# EAGLE design v5.mainboard.omega (EAGLE 9.5.1)
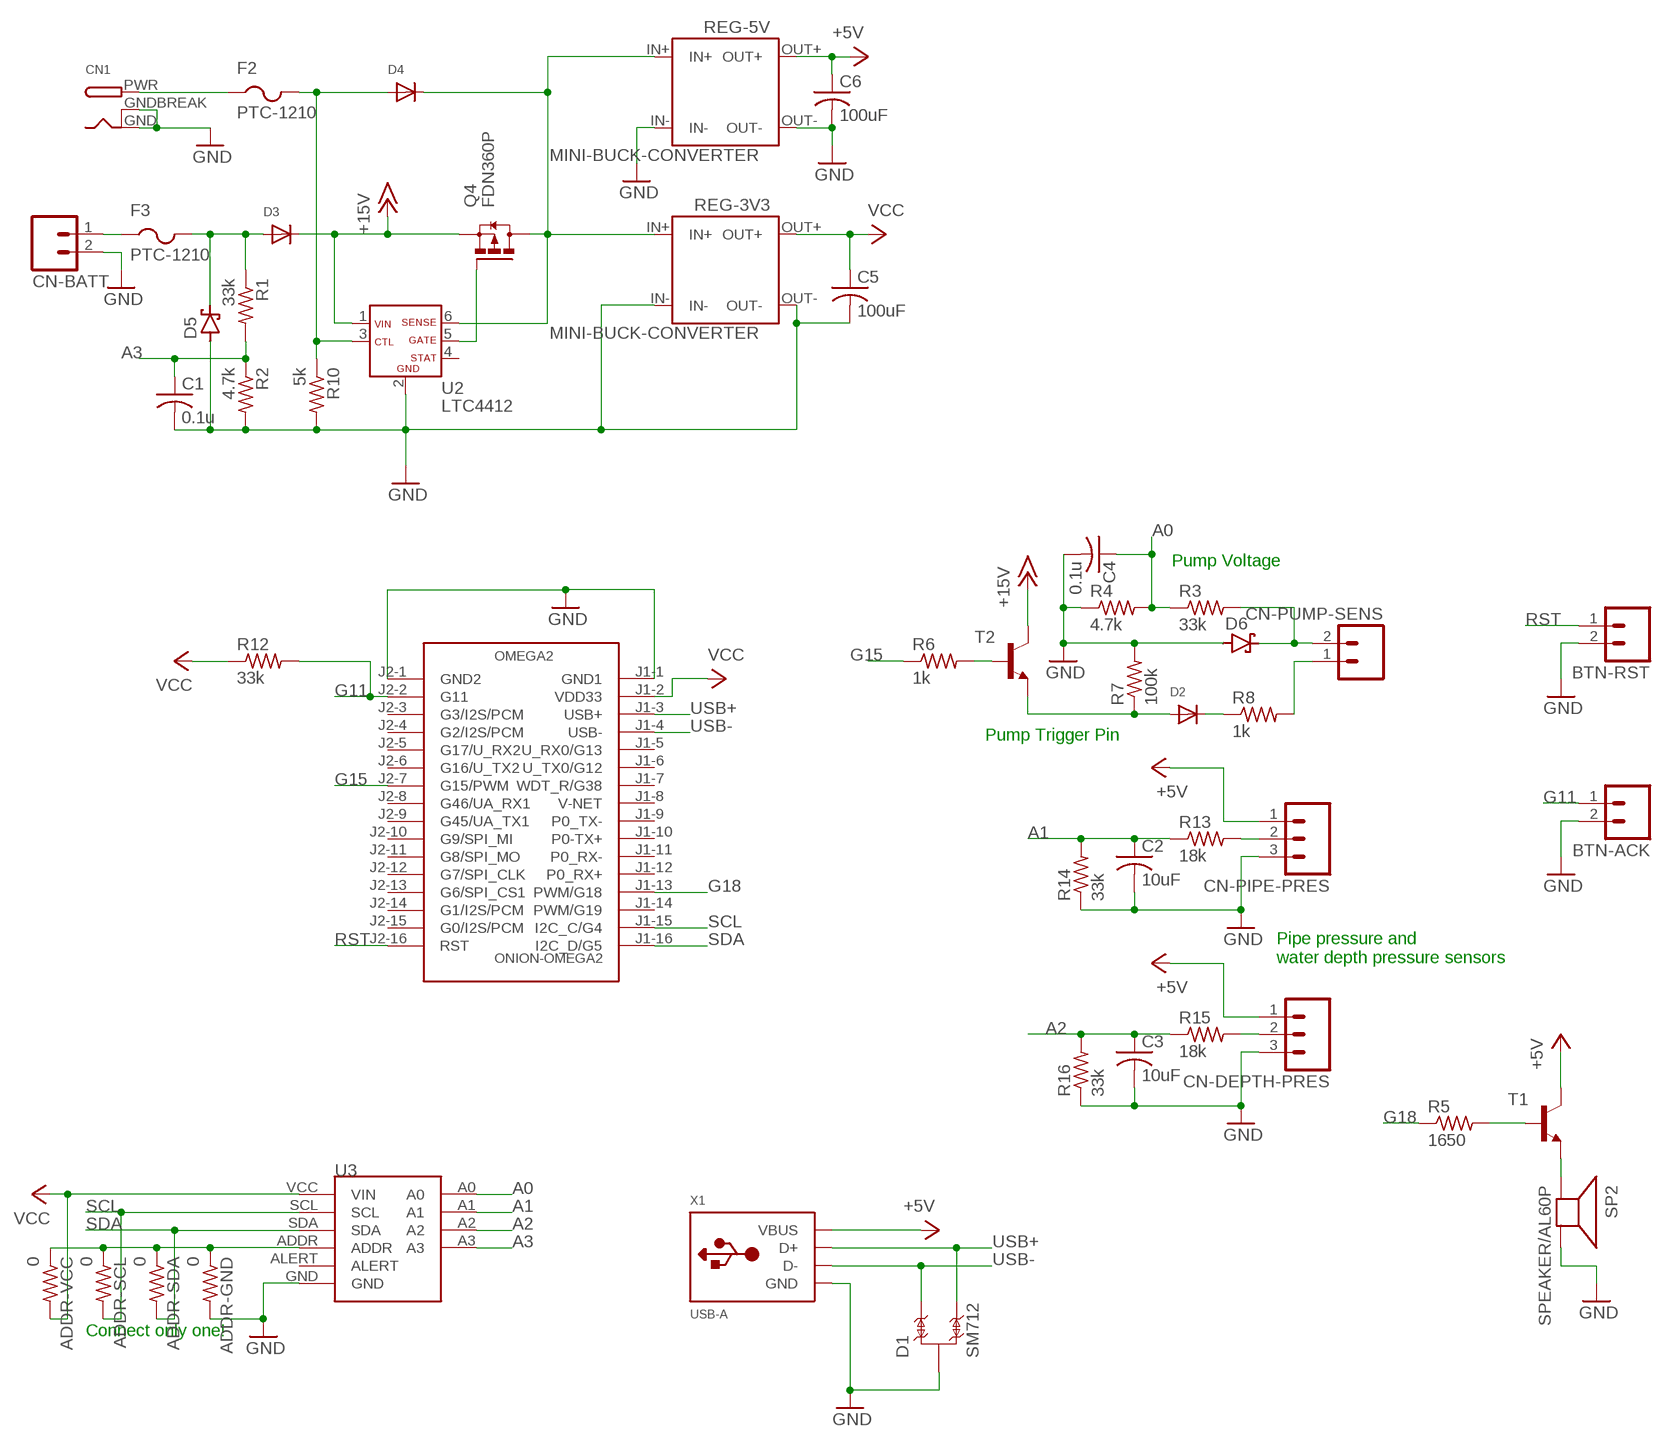
[diagram p0: schematic, sheet 1]

## Parts
ADDR-GND  0  R-US_R0603  [R0603]
ADDR-SCL  0  R-US_R0603  [R0603]
ADDR-SDA  0  R-US_R0603  [R0603]
ADDR-VCC  0  R-US_R0603  [R0603]
BTN-ACK  M02  [02P]
BTN-RST  M02  [02P]
C1  0.1u  C-USC0603K  [C0603K]
C2  10uF  C-USC0805K  [C0805K]
C3  10uF  C-USC0805K  [C0805K]
C4  0.1u  C-USC0603K  [C0603K]
C5  100uF  C-USC2220K  [C2220K]
C6  100uF  C-USC2220K  [C2220K]
CN1  DCBARRELPTH  [DCJACK_2MM_PTH]
CN-BATT  M02  [02P]
CN-DEPTH-PRES  M03  [03P]
CN-PIPE-PRES  M03  [03P]
CN-PUMP-SENS  M02  [02P]
D1  SM712  [SOT23-3]
D2  DIODESMA  [SMADIODE]
D3  DIODESMA  [SMADIODE]
D4  DIODESMA  [SMADIODE]
D5  SCHOTTKY-DIODESMC  [SMC]
D6  SCHOTTKY-DIODESMC  [SMC]
F2  PTC-1210  [1210]
F3  PTC-1210  [1210]
OMEGA2  ONION-OMEGA2  [ONION-2MM-2X16]
Q4  FDN360P  [SUPER-SOT3]
R1  33k  R-US_R0603  [R0603]
R2  4.7k  R-US_R0603  [R0603]
R3  33k  R-US_R0603  [R0603]
R4  4.7k  R-US_R0603  [R0603]
R5  1650  R-US_R0603  [R0603]
R6  1k  R-US_R0603  [R0603]
R7  100k  R-US_R0603  [R0603]
R8  1k  R-US_R0603  [R0603]
R10  5k  R-US_R0603  [R0603]
R12  33k  R-US_R0603  [R0603]
R13  18k  R-US_R0603  [R0603]
R14  33k  R-US_R0603  [R0603]
R15  18k  R-US_R0603  [R0603]
R16  33k  R-US_R0603  [R0603]
REG-3V3  MINI-BUCK-CONVERTER  [MINI-BUCK-CONVERTER]
REG-5V  MINI-BUCK-CONVERTER  [MINI-BUCK-CONVERTER]
SP2  SPEAKER/AL60P  [AL60P]
T1  BC808-NPN-SOT23-BEC  [SOT23-BEC]
T2  BC808-NPN-SOT23-BEC  [SOT23-BEC]
U2  LTC4412  [SOT23-6]
U3  GY-ADS1115THM  [GY-ADS1115-THM]
X1  USB-A  [MOLEX_480371000]

## Nets
+5V: C6.1 CN-DEPTH-PRES.1 CN-PIPE-PRES.1 REG-5V.OUT+ T1.C X1.1(VBUS)
+15V: D3.C Q4.2(S) T2.C U2.1(VIN)
A0: C4.1 R3.1 R4.2 U3.A0
A1: C2.1 R13.1 R14.2 U3.A1
A2: C3.1 R15.1 R16.2 U3.A2
A3: C1.1 R1.2 R2.1 U3.A3
G11: BTN-ACK.1 OMEGA2.J2-2(G11) R12.2
G15: OMEGA2.J2-7(G15/PWM) R6.1
G18: OMEGA2.J1-13(PWM/G18) R5.1
GND: ADDR-GND.2 BTN-ACK.2 BTN-RST.2 C1.2 C2.2 C3.2 C4.2 C5.2 C6.2 CN1.GND CN1.GNDBREAK CN-BATT.2 CN-DEPTH-PRES.3 CN-PIPE-PRES.3 D1.3 D5.A D6.A OMEGA2.J1-1(GND1) OMEGA2.J2-1(GND2) R2.2 R4.1 R7.2 R10.2 R14.1 R16.1 REG-3V3.IN- REG-3V3.OUT- REG-5V.IN- REG-5V.OUT- SP2.2(-) U2.2(GND) U3.GND X1.4(GND)
N$1: Q4.1(G) U2.5(GATE)
N$3: ADDR-GND.1 ADDR-SCL.1 ADDR-SDA.1 ADDR-VCC.1 U3.ADDR
N$4: CN-PUMP-SENS.2 D6.C R3.2
N$5: D2.C R8.1
N$6: CN-PUMP-SENS.1 R8.2
N$7: CN-DEPTH-PRES.2 R15.2
N$8: R5.2 T1.B
N$9: SP2.1(+) T1.E
N$10: CN-PIPE-PRES.2 R13.2
N$12: R6.2 T2.B
N$13: D3.A D5.C F3.2 R1.1
N$14: D2.A R7.1 T2.E
N$15: CN-BATT.1 F3.1
N$16: D4.C Q4.3(D) REG-3V3.IN+ REG-5V.IN+ U2.6(SENSE)
N$17: CN1.PWR F2.1
N$18: D4.A F2.2 R10.1 U2.3(CTL)
RST: BTN-RST.1 OMEGA2.J2-16(RST)
SCL: ADDR-SCL.2 OMEGA2.J1-15(I2C_C/G4) U3.SCL
SDA: ADDR-SDA.2 OMEGA2.J1-16(I2C_D/G5) U3.SDA
USB+: D1.1 OMEGA2.J1-3(USB+) X1.3(D+)
USB-: D1.2 OMEGA2.J1-4(USB-) X1.2(D-)
VCC: ADDR-VCC.2 C5.1 OMEGA2.J1-2(VDD33) R12.1 REG-3V3.OUT+ U3.VCC(VIN)
Unconnected: OMEGA2.J1-5(U_RX0/G13) OMEGA2.J1-6(U_TX0/G12) OMEGA2.J1-7(WDT_R/G38) OMEGA2.J1-8(V-NET) OMEGA2.J1-9(P0_TX-) OMEGA2.J1-10(P0-TX+) OMEGA2.J1-11(P0_RX-) OMEGA2.J1-12(P0_RX+) OMEGA2.J1-14(PWM/G19) OMEGA2.J2-3(G3/I2S/PCM) OMEGA2.J2-4(G2/I2S/PCM) OMEGA2.J2-5(G17/U_RX2) OMEGA2.J2-6(G16/U_TX2) OMEGA2.J2-8(G46/UA_RX1) OMEGA2.J2-9(G45/UA_TX1) OMEGA2.J2-10(G9/SPI_MI) OMEGA2.J2-11(G8/SPI_MO) OMEGA2.J2-12(G7/SPI_CLK) OMEGA2.J2-13(G6/SPI_CS1) OMEGA2.J2-14(G1/I2S/PCM) OMEGA2.J2-15(G0/I2S/PCM) U2.4(STAT) U3.ALERT

## Notes on the sheet
- Pump Voltage
- Pump Trigger Pin
- Pipe pressure and 
  water depth pressure sensors
- Connect only one!

## Library data of the parts
ADDR-GND ADDR-SCL ADDR-SDA ADDR-VCC R1-R8 R10 R12-R16 = adafruit:R-US_: RESISTOR, American symbol
BTN-ACK BTN-RST CN-BATT CN-PUMP-SENS = con-amp-quick:M02: AMP QUICK CONNECTOR; OC_FARNELL: unknown; OC_NEWARK: unknown
C1-C6 = adafruit:C-US: CAPACITOR, American symbol
CN1 = adafruit:DCBARREL: 2.0mm DC Barrel Jack DCJACK_2MM_PTH - Through Hole Jack (4UConnector: 05537)
CN-DEPTH-PRES CN-PIPE-PRES = con-amp-quick:M03: AMP QUICK CONNECTOR; OC_FARNELL: unknown; OC_NEWARK: unknown
D1 = serge:SM712: SM712 Series 600W Asymmetrical TVS Diode Array; Datasheet: http://www.littelfuse.com/~/media/electronics/datasheets/tvs_diode_arrays/littelfuse_tvs_diode_array_sm712_datasheet.pdf.pdf
D2-D4 = adafruit:DIODE: Diode SMADIODE - SMA Surface Mount Package 20V 1A Schottky Diode Digikey: 641-1014-6-ND DO-1N4148 - Through Hole Small Current Diode SOD-123 20V 1 A (.5mV Vf) Schottky Diode - Digikey: MBRX120TPMSCT-ND SOD-323 10V 570mA (.38mV Vf, 3ns) Schottky Diode - Digikey: ZLLS410CT-ND SOD-523 30V 30mA Schottky Diode (RB751S-40TE61) - Digikey: RB751S-40TE61CT-ND SOT23-R/W - SOT23 Package (R = Solder Paste/Reflow Ovens, W = Hand-Soldering) BAT54Film 40V 300mA - Digikey: 497-7162-1-ND
D5 D6 = diode:SCHOTTKY-DIODE: Schottky Diode
F2 F3 = serge:PTC-1210
OMEGA2 = omega:ONION-OMEGA2: Onion Omega
Q4 = transistor-power:FDN360P: Single P-Channel, PowerTrench (R) MOSFET Source: http://www.fairchildsemi.com/ds/FD/FDN360P.pdf
REG-3V3 REG-5V = serge:MINI-BUCK-CONVERTER
SP2 = adafruit:SPEAKER: SPEAKER Source: Buerklin Added PS12 (for part # PS1240 piezo) http://www.ladyada.net/library/pcb/eaglelibrary.html
T1 T2 = transistor:*-NPN-: NPN Transistror BF959 corrected 2008.03.06
U2 = U-LT-LTC4412-ideal-diode:LTC4412
U3 = serge:GY-ADS1115
X1 = adafruit:USB-A: USB type A 'plug' Used for things that can directly connect to a USB port, say USB key

## Board
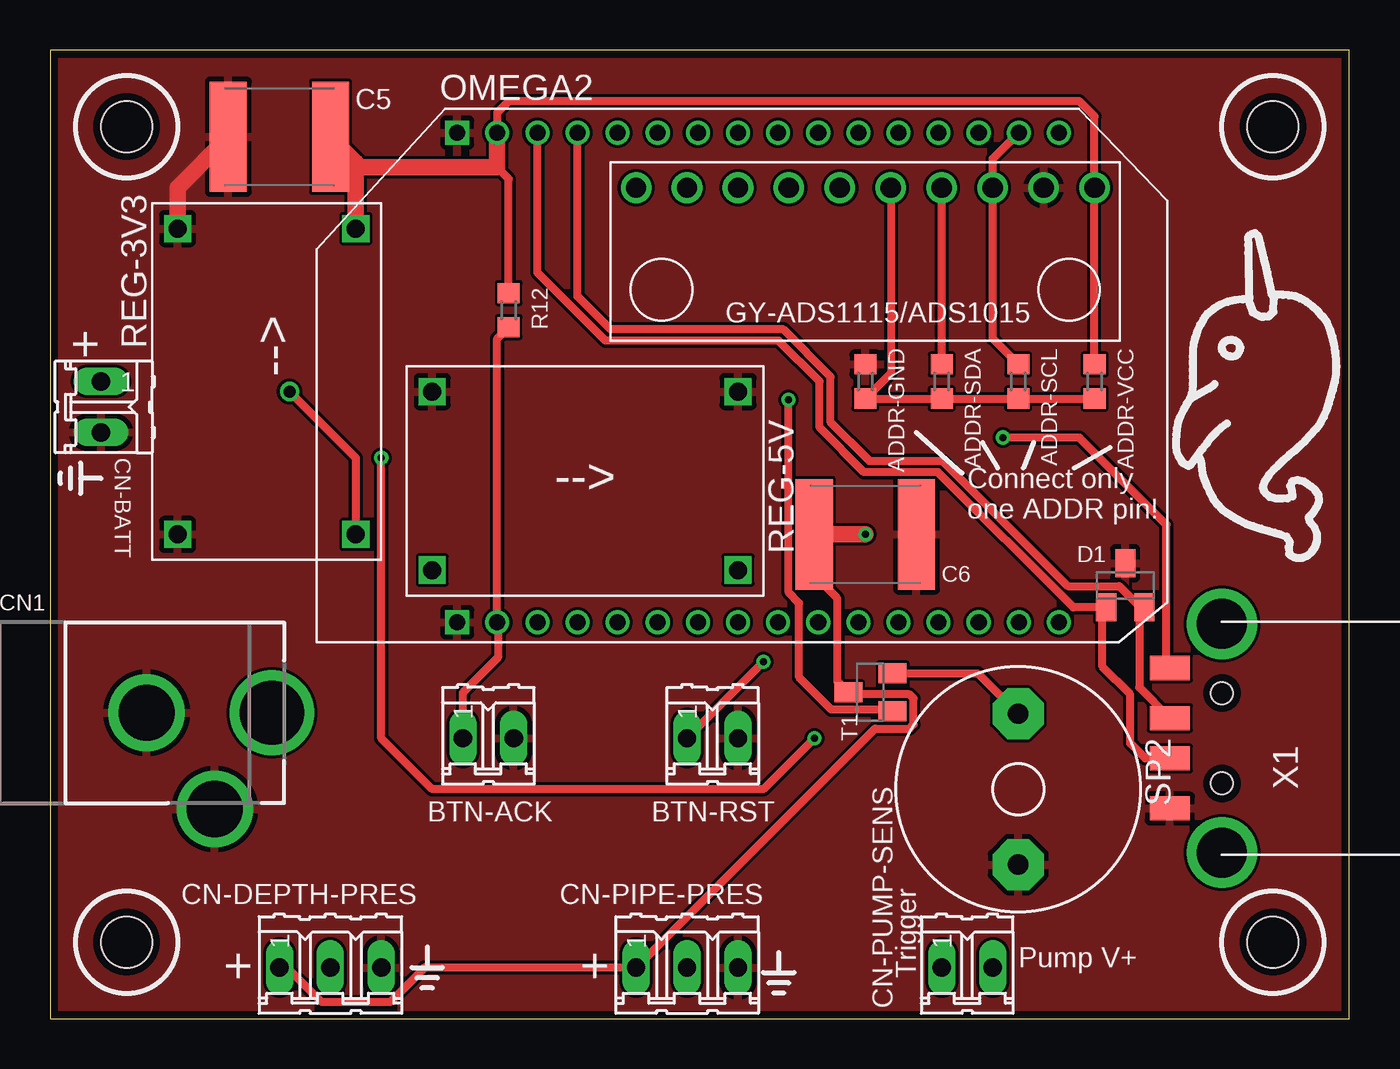
[diagram p1: board, top side]
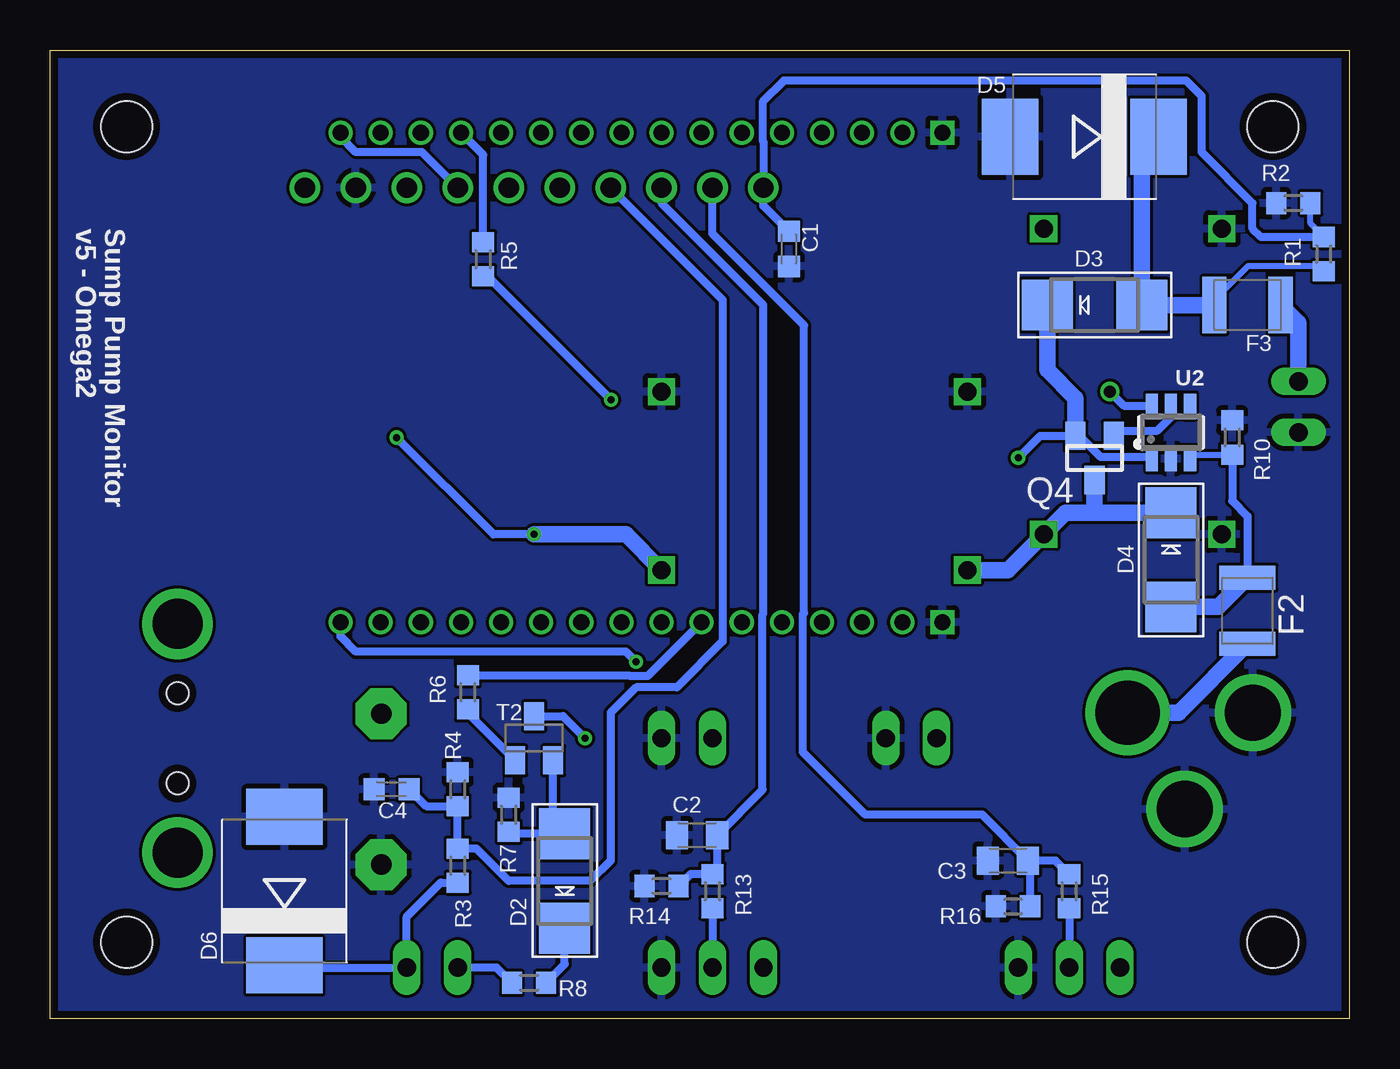
[diagram p2: board, bottom side, seen from below]

Size 64.77 x 48.26 mm. Coordinates in mm from the lower left corner, seen from the top.
Outline: 0,0 64.77,0 64.77,48.26 0,48.26 0,0
Copper layers (1*16): Top 0.0356mm / dielectric 1.5011mm / Bottom 0.0356mm
Design rules "LaenPCBOrder": minimum track width 6mil, minimum drill 13mil, track to track 6mil, track to pad 6mil, pad to pad 6mil, via to via 6mil, smd to smd 6mil, copper to edge 15mil, drill to drill 6mil, minimum pad ring 7mil, minimum via ring 7mil, stop-mask expansion 4mil, vias tented up to drill 0mil, thermal gap 10mil
Holes 2.54 mm at 3.81,3.81 60.96,3.81 60.96,44.45 3.81,44.45

### Footprints (pad centres in the part's own frame; a part is rotated, then mirrored left to right if it is on the bottom)
R0603 = smd 1 x 1.1: 1 -0.85,0; 2 0.85,0
02P = drill 0.914 long: 1 -1.27,0; 2 1.27,0
C0603K = smd 1.05 x 1.08: 1 -0.875,0; 2 0.875,0
C0805K = smd 1.1 x 1.4: 1 -1,0; 2 1,0
C2220K = smd 1.85 x 5.5: 1 -2.55,0; 2 2.55,0
DCJACK_2MM_PTH = drill 2.8: GND 0,7.35; GNDBREAK 4.8,10.75 | drill 3.2: PWR 0,13.6
03P = drill 0.914 long: 1 -2.54,0; 2 0,0; 3 2.54,0
SOT23-3 = smd 1 x 1.4: 1 -0.95,-1.1; 2 0.95,-1.1; 3 0,1.1
SMADIODE = smd 2.54 x 2.54: A 2.349,0; C -2.349,0
SMC = smd 2.8 x 3.8: A 3.7,0; C -3.7,0
1210 = smd 1.2 x 2.8: 1 -1.65,0; 2 1.65,0
ONION-2MM-2X16 = drill 0.8 square: J1-1 12.4,14; J2-1 -12,14 | drill 0.8: J1-2 12.4,12; J1-3 12.4,10; J1-4 12.4,8; J1-5 12.4,6; J1-6 12.4,4; J1-7 12.4,2; J1-8 12.4,0; J1-9 12.4,-2; J1-10 12.4,-4; J1-11 12.4,-6; J1-12 12.4,-8; J1-13 12.4,-10; J1-14 12.4,-12; J1-15 12.4,-14; J1-16 12.4,-16; J2-2 -12,12; J2-3 -12,10; J2-4 -12,8; J2-5 -12,6; J2-6 -12,4; J2-7 -12,2; J2-8 -12,0; J2-9 -12,-2; J2-10 -12,-4; J2-11 -12,-6; J2-12 -12,-8; J2-13 -12,-10; J2-14 -12,-12; J2-15 -12,-14; J2-16 -12,-16
SUPER-SOT3 = smd 1 x 1.4: 1 -0.95,-1.1; 2 0.95,-1.1; 3 0,1.1
MINI-BUCK-CONVERTER = drill 0.9 square: IN+ 10.16,1.27; IN- 1.27,1.27; OUT+ 10.16,16.51; OUT- 1.27,16.51
AL60P = drill 1.016 pad 2.54 octagon: 1 -3.759,0; 2 3.759,0
SOT23-BEC = smd 1 x 1.4: B -0.95,-1.1; C 0,1.1; E 0.95,-1.1
SOT23-6 = smd 0.6 x 1.25: 1 0.95,1.31; 2 0,1.31; 3 -0.95,1.31; 4 -0.95,-1.31; 5 0,-1.31; 6 0.95,-1.31
GY-ADS1115-THM = drill 1.016: A0 -3.81,0; A1 -6.35,0; A2 -8.89,0; A3 -11.43,0; ADDR 1.27,0; ALERT -1.27,0; GND 8.89,0; SCL 6.35,0; SDA 3.81,0; VCC 11.43,0
MOLEX_480371000 = smd 1.2 x 2: 1 3.5,2.6; 2 1,2.6; 3 -1,2.6; 4 -3.5,2.6 | drill 2.5: M1 -5.7,0; M2 5.7,0 | hole 1.1: -2.25,0; 2.25,0

### Placement (x,y rotation side)
ADDR-GND  40.64,31.75 90 top
ADDR-SCL  48.26,31.75 90 top
ADDR-SDA  44.45,31.75 90 top
ADDR-VCC  52.07,31.75 90 top
BTN-ACK  21.84,13.97 0 top
BTN-RST  33.02,13.97 0 top
C1  27.94,38.35 270 bottom
C2  32.51,9.14 180 bottom
C3  17.02,7.87 180 bottom
C4  47.75,11.43 180 bottom
C5  11.43,43.94 180 top
C6  40.64,24.13 0 top
CN1  -2.54,15.24 270 top
CN-BATT  2.54,30.48 270 top
CN-DEPTH-PRES  13.97,2.54 0 top
CN-PIPE-PRES  31.75,2.54 0 top
CN-PUMP-SENS  45.72,2.54 0 top
D1  53.59,21.59 0 top
D2  39.12,6.86 90 bottom
D3  12.7,35.56 0 bottom
D4  8.89,22.86 270 bottom
D5  13.21,43.94 180 bottom
D6  53.09,6.35 90 bottom
F2  5.08,20.32 90 bottom
F3  5.08,35.56 180 bottom
OMEGA2  34.29,31.75 90 top
Q4  12.7,27.94 180 bottom
R1  1.27,38.1 90 bottom
R2  2.79,40.64 180 bottom
R3  44.45,7.62 270 bottom
R4  44.45,11.43 270 bottom
R5  43.18,37.85 270 bottom
R6  43.94,16.26 270 bottom
R7  41.91,10.16 90 bottom
R8  40.89,1.78 180 bottom
R10  5.84,28.96 90 bottom
R12  22.86,35.31 270 top
R13  31.75,6.35 270 bottom
R14  34.29,6.6 0 bottom
R15  13.97,6.35 270 bottom
R16  16.76,5.59 0 bottom
REG-3V3  5.08,22.86 0 top
REG-5V  17.78,32.51 270 top
SP2  48.26,11.43 270 top
T1  40.89,16.26 90 top
T2  40.64,13.97 0 bottom
U2  8.89,29.21 180 bottom
U3  40.64,41.4 0 top
X1  58.42,13.97 90 top

### Tracks (layer width: path | path; a pad name or v marks a point on that pad's centre or on a via)
+5V  (via drill 0.35)
  Top 0.4: CN-DEPTH-PRES.1 11.82,2.54 13.54,0.82 16.94,0.82 18.66,2.54 CN-PIPE-PRES.1 41.12,14.45 42.84,14.45 43.05,14.66 43.05,15.95 42.84,16.16 39.89,16.16 T1.C
  Top 0.406: T1.C 39.25,16.8 39.25,20.94 38.09,22.1 C6.1 | X1.1 55.65,17.64 55.65,24.62 51.32,28.96 v47.5,28.96
  Top 0.813: C6.1 v40.64,24.13
  Bottom 0.406: v47.5,28.96 42.67,24.13 v40.64,24.13
  Bottom 0.813: REG-5V.OUT+ 36.07,24.13 v40.64,24.13
+15V  (via drill 0.35)
  Top 0.406: v38.1,13.97 35.56,11.43 19.05,11.43 16.51,13.97 v16.51,27.94
  Bottom 0.4: U2.1 9.92,27.98
  Bottom 0.406: 9.92,27.98 10.16,27.98 12.4,27.98 13.45,29.04 Q4.2 15.41,29.04 v16.51,27.94 | T2.C 39.2,15.07 v38.1,13.97
  Bottom 0.813: D3.C 15.05,32.32 13.65,30.92 Q4.2
A0
  Bottom 0.406: C4.1 46.03,10.58 R4.2 R3.1 43.52,8.47 41.91,6.86 37.85,6.86 36.83,7.87 36.83,15.24 35.56,16.51 33.53,16.51 31.24,18.8 31.24,19.35 31.25,19.35 31.25,35.82 U3.A0
A1
  Bottom 0.406: R14.2 32.84,7.2 R13.1 31.51,7.44 C2.1 29.25,11.41 29.25,20.15 29.21,20.18 29.21,35.56 34.29,40.64 U3.A1
A2
  Bottom 0.406: R15.1 14.64,7.87 C3.1 | R16.2 15.91,7.77 C3.1 | C3.1 18.3,10.16 24.13,10.16 27.25,13.28 27.25,20.15 27.18,20.21 27.18,34.54 31.75,39.12 U3.A2
A3
  Bottom 0.305: R1.2 1.94,39.62 R2.1
  Bottom 0.406: R1.2 4.41,38.95 4.83,39.37 4.83,40.64 7.37,43.18 7.37,45.97 8.13,46.74 28.19,46.74 29.25,45.68 29.25,43.75 29.21,43.72 U3.A3 29.21,40.5 C1.1
G11
  Top 0.406: R12.2 22.29,33.89 OMEGA2.J2-2 22.35,19.69 22.35,18.03 20.57,16.26 BTN-ACK.1
G15
  Bottom 0.406: R6.1 35.89,17.11 35.85,17.07 34.97,17.07 OMEGA2.J2-7
G18
  Bottom 0.406: R5.1 43.18,43.04 OMEGA2.J1-13
GND
  Top 0.813: C5.2 6.35,41.41 REG-3V3.OUT-
  pour Top: 0,48.26 64.77,48.26 64.77,0 0,0
  pour Bottom: 0,48.26 64.77,48.26 64.77,0 0,0
N$1
  Bottom 0.4: U2.5 8.89,29.97
  Bottom 0.406: 8.89,29.97 9.57,29.29 11.5,29.29 Q4.1
N$3
  Top 0.4: U3.ADDR 41.91,32.17 ADDR-GND.1 ADDR-SDA.1 ADDR-SCL.1 ADDR-VCC.1
N$4
  Bottom 0.406: R3.2 45.3,6.77 46.99,5.08 CN-PUMP-SENS.2 52.98,2.54 D6.C
N$5
  Bottom 0.406: R8.1 39.12,2.71 D2.C
N$6
  Bottom 0.406: R8.2 42.51,2.54 CN-PUMP-SENS.1
N$7
  Bottom 0.406: R15.2 CN-DEPTH-PRES.2
N$8  (via drill 0.35)
  Top 0.406: v36.81,30.84 36.81,21.23 37.33,20.71 37.33,17.01 38.95,15.4 41.9,15.4 T1.B
  Bottom 0.406: v36.81,30.84 42.97,37 R5.2
N$9
  Top 0.406: T1.E 46.24,17.21 SP2.1
N$10
  Bottom 0.406: R13.2 CN-PIPE-PRES.2
N$12
  Bottom 0.406: T2.B 43.94,15.22 R6.2
N$13
  Bottom 0.305: R1.1 1.52,37.5 5.04,37.5 6.73,35.81 F3.2
  Bottom 0.813: F3.2 D3.A 10.35,43.1 D5.C
N$14
  Bottom 0.406: T2.E 39.69,9.78 D2.A 41.81,9.21 R7.1
N$15
  Bottom 0.813: CN-BATT.1 2.54,34.67 F3.1
N$16  (via drill 0.61)
  Top 0.406: v11.94,31.24 15.24,27.94 REG-3V3.IN+
  Bottom 0.4: U2.6 11.22,30.52
  Bottom 0.406: 11.22,30.52 v11.94,31.24
  Bottom 0.813: D4.C 12.7,25.21 | 12.7,25.21 14.16,25.21 REG-3V3.IN+ 17.02,22.35 REG-5V.IN+ | Q4.3 12.7,25.21
N$17
  Bottom 0.813: CN1.PWR 8.51,15.24 F2.1
N$18
  Bottom 0.305: 7.73,28.11 R10.1
  Bottom 0.4: U2.3 7.73,28.11 | R10.1 5.84,25.8 5.08,25.04
  Bottom 0.406: 5.08,25.04 F2.2
  Bottom 0.813: F2.2 6.54,20.51 D4.A
RST  (via drill 0.35)
  Top 0.406: BTN-RST.1 v35.56,17.78
  Bottom 0.406: v35.56,17.78 36.07,18.29 49.53,18.29 50.29,19.05 OMEGA2.J2-16
SCL
  Top 0.4: ADDR-SCL.2 46.99,33.87 U3.SCL 46.99,42.85 OMEGA2.J1-15
SDA
  Top 0.4: ADDR-SDA.2 U3.SDA
  Bottom 0.4: U3.SDA 46.23,43.18 49.53,43.18 50.29,43.94 OMEGA2.J1-16
USB+
  Top 0.406: X1.3 54.59,12.97 53.85,13.72 53.85,16.15 52.46,17.54 52.46,20.49 D1.1 51.01,20.49 44.26,27.24 40.58,27.24 38.35,29.46 38.35,31.75 36.32,33.78 27.69,33.78 24.29,37.18 OMEGA2.J1-3
USB-
  Top 0.406: X1.2 54.29,16.5 54.29,20.24 D1.2 54.35,20.49 53.29,21.55 50.74,21.55 44.49,27.79 40.84,27.79 38.91,29.72 38.91,31.98 36.55,34.34 27.94,34.34 26.29,35.99 OMEGA2.J1-4
VCC
  Top 0.4: ADDR-VCC.2 U3.VCC 52.07,44.96 51.31,45.72 22.86,45.72 22.29,45.15 OMEGA2.J1-2
  Top 0.406: R12.1 22.86,41.85 22.29,42.42
  Top 0.813: C5.1 15.24,42.68 15.24,42.42 | 15.24,42.42 REG-3V3.OUT+ | OMEGA2.J1-2 22.29,42.42 15.24,42.42

### Text on the board
tPlace: + | Pump V+ | + | + | Trigger
bPlace: Sump Pump Monitor / v5 - Omega2
tNames: --> | --> | Connect only / one ADDR pin!